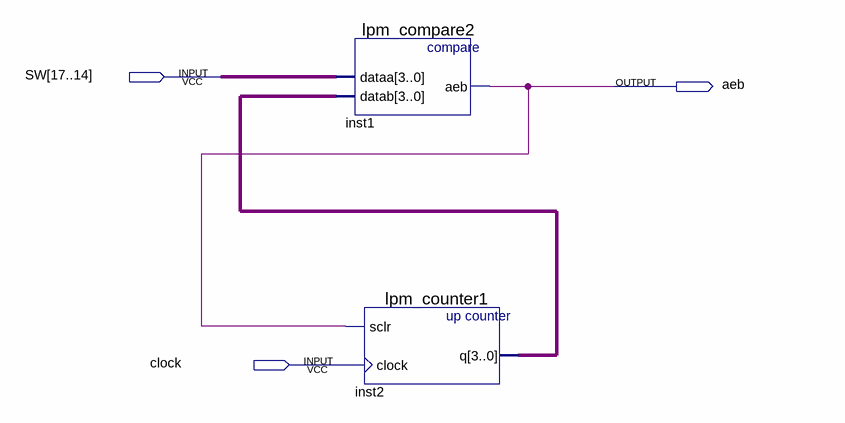
[diagram p0: schematic sheet]
// Quartus schematic processor.bdf as structural Verilog: 2 symbols, 3 pins
module processor (
  input  [17:14] SW,
  input  clock,
  output aeb
);

  wire [3:0] inst2_q;

  lpm_compare2 inst1 (.dataa(SW), .datab(inst2_q), .aeb(aeb));
  lpm_counter1 inst2 (.sclr(aeb), .clock(clock), .q(inst2_q));
endmodule
